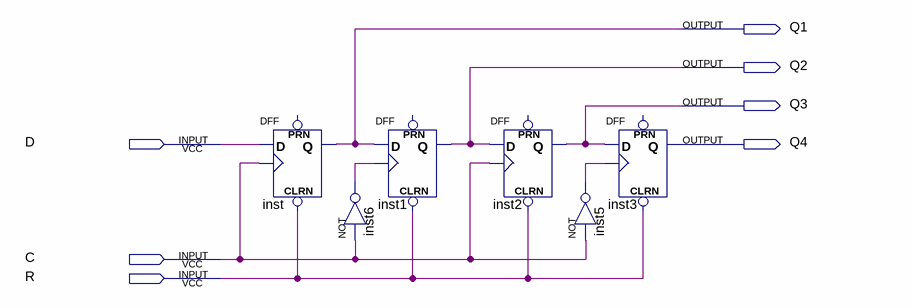
[diagram p0: schematic sheet]
// Quartus schematic double_shift_reg.bdf as structural Verilog: 6 symbols, 7 pins
module double_shift_reg (
  input  D,
  input  C,
  input  R,
  output Q1,
  output Q2,
  output Q3,
  output Q4
);

  wire inst5_out, inst6_out;

  DFF inst (.CLRN(R), .CLK(C), .D(D), .Q(Q1));  // open: PRN
  not inst6 (inst6_out, C);
  DFF inst1 (.CLRN(R), .CLK(inst6_out), .D(Q1), .Q(Q2));  // open: PRN
  DFF inst2 (.CLRN(R), .CLK(C), .D(Q2), .Q(Q3));  // open: PRN
  not inst5 (inst5_out, C);
  DFF inst3 (.CLRN(R), .CLK(inst5_out), .D(Q3), .Q(Q4));  // open: PRN
endmodule
